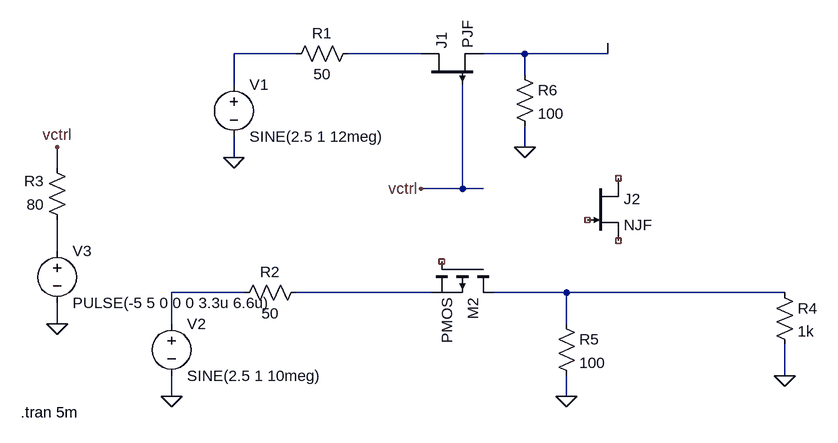
[diagram p0: schematic fsk-modulator.asc]
fsk-modulator.asc, the LTspice schematic file:
Version 4
SHEET 1 1028 680
WIRE 208 -160 112 -160
WIRE 400 -160 288 -160
WIRE 560 -160 496 -160
WIRE 688 -160 688 -176
WIRE 688 -160 560 -160
WIRE 560 -128 560 -160
WIRE 112 -112 112 -160
WIRE 560 -16 560 -48
WIRE 112 0 112 -32
WIRE -160 16 -160 -16
WIRE 464 48 464 -112
WIRE 464 48 400 48
WIRE 496 48 464 48
WIRE -160 144 -160 96
WIRE 128 208 16 208
WIRE 416 208 208 208
WIRE 624 208 512 208
WIRE 960 208 624 208
WIRE -160 256 -160 224
WIRE 16 256 16 208
WIRE 624 256 624 208
WIRE 960 336 960 288
WIRE 16 368 16 336
WIRE 624 368 624 336
FLAG 112 0 0
FLAG 16 368 0
FLAG -160 256 0
FLAG 960 336 0
FLAG 624 368 0
FLAG -160 -16 vctrl
FLAG 400 48 vctrl
FLAG 560 -16 0
SYMBOL voltage 112 -128 R0
WINDOW 123 0 0 Left 0
WINDOW 39 0 0 Left 0
SYMATTR InstName V1
SYMATTR Value SINE(2.5 1 12meg)
SYMBOL voltage 16 240 R0
WINDOW 123 0 0 Left 0
WINDOW 39 0 0 Left 0
SYMATTR InstName V2
SYMATTR Value SINE(2.5 1 10meg)
SYMBOL voltage -160 128 R0
WINDOW 123 0 0 Left 0
WINDOW 39 0 0 Left 0
SYMATTR InstName V3
SYMATTR Value PULSE(-5 5 0 0 0 3.3u 6.6u)
SYMBOL res 304 -176 R90
WINDOW 0 0 56 VBottom 2
WINDOW 3 32 56 VTop 2
SYMATTR InstName R1
SYMATTR Value 50
SYMBOL res 224 192 R90
WINDOW 0 0 56 VBottom 2
WINDOW 3 32 56 VTop 2
SYMATTR InstName R2
SYMATTR Value 50
SYMBOL res -144 112 R180
WINDOW 0 36 76 Left 2
WINDOW 3 36 40 Left 2
SYMATTR InstName R3
SYMATTR Value 80
SYMBOL pmos 512 160 R90
SYMATTR InstName M2
SYMBOL res 944 192 R0
SYMATTR InstName R4
SYMATTR Value 1k
SYMBOL res 608 240 R0
SYMATTR InstName R5
SYMATTR Value 100
SYMBOL res 544 -144 R0
SYMATTR InstName R6
SYMATTR Value 100
SYMBOL pjf 400 -112 R270
SYMATTR InstName J1
SYMBOL njf 656 32 R0
SYMATTR InstName J2
TEXT -216 392 Left 2 !.tran 5m

The netlist it stands for:
* fsk-modulator.asc
V1 N001 0 SINE(2.5 1 12meg)
V2 N005 0 SINE(2.5 1 10meg)
V3 N004 0 PULSE(-5 5 0 0 0 3.3u 6.6u)
R1 N002 N001 50
R2 N006 N005 50
R3 N004 vctrl 80
M2 N007 NC_01 N006 N006 PMOS
R4 N007 0 1k
R5 N007 0 100
R6 N003 0 100
J1 N002 vctrl N003 PJF
J2 NC_02 NC_03 NC_04 NJF
.model NJF NJF
.model PJF PJF
.lib standard.jft
.model NMOS NMOS
.model PMOS PMOS
.lib standard.mos
.tran 5m
.backanno
.end